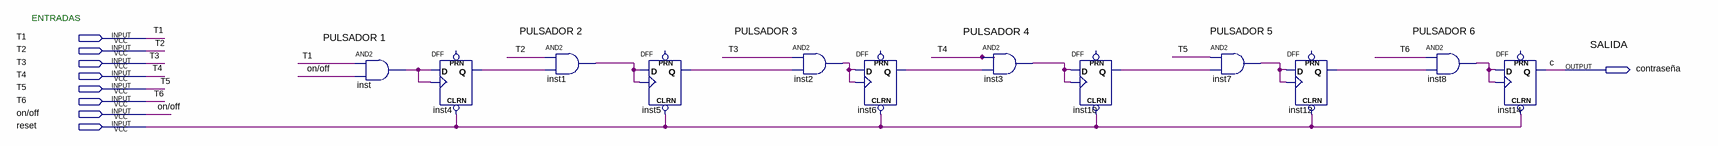
[diagram p0: schematic sheet]
// Quartus schematic flipflops.bdf as structural Verilog: 12 symbols, 9 pins
module flipflops (
  input  T1,
  input  T2,
  input  T3,
  input  T4,
  input  T5,
  input  T6,
  input  \on/off ,
  input  reset,
  output \contraseña 
);

  wire inst1_out, inst2_out, inst3_out, inst4_q, inst5_q, inst6_q, inst7_out, inst8_out, inst10_q, inst12_q,
       inst_out;

  and inst (inst_out, T1, \on/off );
  DFF inst4 (.CLRN(reset), .CLK(inst_out), .D(inst_out), .Q(inst4_q));  // open: PRN
  and inst1 (inst1_out, T2, inst4_q);
  DFF inst5 (.CLRN(reset), .CLK(inst1_out), .D(inst1_out), .Q(inst5_q));  // open: PRN
  and inst2 (inst2_out, T3, inst5_q);
  DFF inst6 (.CLRN(reset), .CLK(inst2_out), .D(inst2_out), .Q(inst6_q));  // open: PRN
  and inst3 (inst3_out, T4, inst6_q);
  DFF inst10 (.CLRN(reset), .CLK(inst3_out), .D(inst3_out), .Q(inst10_q));  // open: PRN
  and inst7 (inst7_out, T5, inst10_q);
  DFF inst12 (.CLRN(reset), .CLK(inst7_out), .D(inst7_out), .Q(inst12_q));  // open: PRN
  and inst8 (inst8_out, T6, inst12_q);
  DFF inst14 (.CLRN(reset), .CLK(inst8_out), .D(inst8_out), .Q(\contraseña ));  // open: PRN

  // Other names for the same wires on the sheet: c = \contraseña 

  // Notes on the sheet:
  //   ENTRADAS
  //   PULSADOR 2
  //   PULSADOR 3
  //   PULSADOR 4
  //   PULSADOR 5
  //   PULSADOR 6
  //   PULSADOR 1
  //   SALIDA
endmodule
